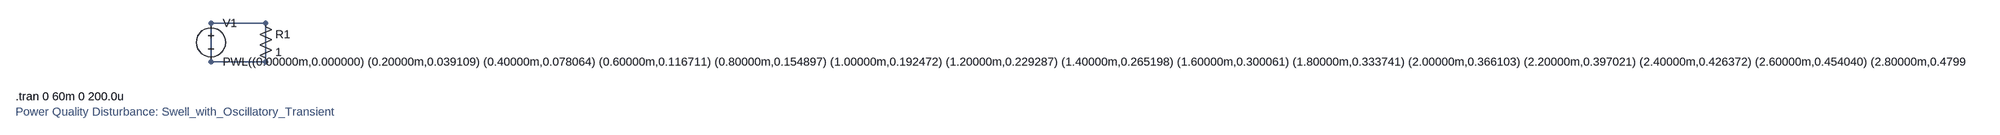
[diagram p0: schematic Swell_with_Oscillatory_Transient.asc]
Swell_with_Oscillatory_Transient.asc, the LTspice schematic file:
Version 4
SHEET 1 880 680
WIRE 192 128 80 128
WIRE 80 128 80 208
WIRE 192 208 80 208
WIRE 192 128 192 208
SYMBOL voltage 80 112 R0
WINDOW 123 0 0 Left 0
WINDOW 39 0 0 Left 0
SYMATTR InstName V1
SYMATTR Value PWL((0.00000m,0.000000) (0.20000m,0.039109) (0.40000m,0.078064) (0.60000m,0.116711) (0.80000m,0.154897) (1.00000m,0.192472) (1.20000m,0.229287) (1.40000m,0.265198) (1.60000m,0.300061) (1.80000m,0.333741) (2.00000m,0.366103) (2.20000m,0.397021) (2.40000m,0.426372) (2.60000m,0.454040) (2.80000m,0.479916) (3.00000m,0.503898) (3.20000m,0.525892) (3.40000m,0.545810) (3.60000m,0.563574) (3.80000m,0.579113) (4.00000m,0.592368) (4.20000m,0.603284) (4.40000m,0.611820) (4.60000m,0.617941) (4.80000m,0.621623) (5.00000m,0.622852) (5.20000m,0.621623) (5.40000m,0.617941) (5.60000m,0.611820) (5.80000m,0.603284) (6.00000m,0.592368) (6.20000m,0.579113) (6.40000m,0.563574) (6.60000m,0.545810) (6.80000m,0.525892) (7.00000m,0.503898) (7.20000m,0.479916) (7.40000m,0.454040) (7.60000m,0.426372) (7.80000m,0.397021) (8.00000m,0.366103) (8.20000m,0.333741) (8.40000m,0.300061) (8.60000m,0.265198) (8.80000m,0.229287) (9.00000m,0.192472) (9.20000m,0.154897) (9.40000m,0.116711) (9.60000m,0.078064) (9.80000m,0.039109) (10.00000m,0.000000) (10.20000m,-0.039109) (10.40000m,-0.078064) (10.60000m,-0.116711) (10.80000m,-0.154897) (11.00000m,-0.192472) (11.20000m,-0.229287) (11.40000m,-0.265198) (11.60000m,-0.300061) (11.80000m,-0.333741) (12.00000m,-0.366103) (12.20000m,-0.397021) (12.40000m,-0.426372) (12.60000m,-0.454040) (12.80000m,-0.479916) (13.00000m,-0.503898) (13.20000m,-0.525892) (13.40000m,-0.545810) (13.60000m,-0.563574) (13.80000m,-0.579113) (14.00000m,-0.592368) (14.20000m,-0.603284) (14.40000m,-0.611820) (14.60000m,-0.617941) (14.80000m,-0.621623) (15.00000m,-0.622852) (15.20000m,-0.621623) (15.40000m,-0.617941) (15.60000m,-0.611820) (15.80000m,-0.603284) (16.00000m,-0.592368) (16.20000m,-0.579113) (16.40000m,-0.563574) (16.60000m,-0.545810) (16.80000m,-0.525892) (17.00000m,-0.503898) (17.20000m,-0.479916) (17.40000m,-0.454040) (17.60000m,-0.426372) (17.80000m,-0.397021) (18.00000m,-0.366103) (18.20000m,-0.333741) (18.40000m,-0.300061) (18.60000m,-0.265198) (18.80000m,-0.229287) (19.00000m,-0.192472) (19.20000m,-0.154897) (19.40000m,-0.116711) (19.60000m,-0.078064) (19.80000m,-0.039109) (20.00000m,-0.000000) (20.20000m,0.058664) (20.40000m,0.117096) (20.60000m,0.175066) (20.80000m,0.232346) (21.00000m,0.288708) (21.20000m,0.343931) (21.40000m,0.397796) (21.60000m,0.450092) (21.80000m,0.500611) (22.00000m,0.549155) (22.20000m,0.595532) (22.40000m,0.639558) (22.60000m,0.681060) (22.80000m,0.719874) (23.00000m,0.755847) (23.20000m,0.788837) (23.40000m,0.818715) (23.60000m,0.845361) (23.80000m,0.868670) (24.00000m,0.888552) (24.20000m,0.904926) (24.40000m,0.917730) (24.60000m,0.926912) (24.80000m,0.932435) (25.00000m,0.934279) (25.20000m,0.932435) (25.40000m,0.926912) (25.60000m,0.917730) (25.80000m,0.904926) (26.00000m,0.888552) (26.20000m,0.868670) (26.40000m,0.845361) (26.60000m,0.818715) (26.80000m,0.788837) (27.00000m,0.755847) (27.20000m,0.719874) (27.40000m,0.681060) (27.60000m,0.639558) (27.80000m,0.595532) (28.00000m,0.549155) (28.20000m,0.500611) (28.40000m,0.450092) (28.60000m,0.397796) (28.80000m,0.343931) (29.00000m,0.288708) (29.20000m,0.232346) (29.40000m,0.175066) (29.60000m,0.117096) (29.80000m,0.058664) (30.00000m,0.000000) (30.20000m,0.029808) (30.40000m,0.041605) (30.60000m,0.027285) (30.80000m,-0.017043) (31.00000m,-0.090793) (31.20000m,-0.189257) (31.40000m,-0.304508) (31.60000m,-0.426680) (31.80000m,-0.545423) (32.00000m,-0.651324) (32.20000m,-0.737103) (32.40000m,-0.798437) (32.60000m,-0.834322) (32.80000m,-0.846952) (33.00000m,-0.841186) (33.20000m,-0.823667) (33.40000m,-0.801782) (33.60000m,-0.782577) (33.80000m,-0.771805) (34.00000m,-0.773217) (34.20000m,-0.788175) (34.40000m,-0.815624) (34.60000m,-0.852395) (34.80000m,-0.893780) (35.00000m,-0.934279) (35.20000m,-0.968405) (35.40000m,-0.991434) (35.60000m,-1.000000) (35.80000m,-0.992462) (36.00000m,-0.969018) (36.20000m,-0.931556) (36.40000m,-0.883289) (36.60000m,-0.828233) (36.80000m,-0.770618) (37.00000m,-0.714309) (37.20000m,-0.662315) (37.40000m,-0.616464) (37.60000m,-0.577246) (37.80000m,-0.543865) (38.00000m,-0.514459) (38.20000m,-0.486451) (38.40000m,-0.456976) (38.60000m,-0.423322) (38.80000m,-0.383313) (39.00000m,-0.335599) (39.20000m,-0.279813) (39.40000m,-0.216579) (39.60000m,-0.147392) (39.80000m,-0.074380) (40.00000m,-0.000000) (40.20000m,0.053734) (40.40000m,0.104297) (40.60000m,0.150159) (40.80000m,0.190486) (41.00000m,0.225187) (41.20000m,0.254855) (41.40000m,0.280618) (41.60000m,0.303931) (41.80000m,0.326334) (42.00000m,0.349215) (42.20000m,0.373619) (42.40000m,0.400109) (42.60000m,0.428706) (42.80000m,0.458910) (43.00000m,0.489792) (43.20000m,0.520134) (43.40000m,0.548609) (43.60000m,0.573952) (43.80000m,0.595125) (44.00000m,0.611432) (44.20000m,0.622583) (44.40000m,0.628698) (44.60000m,0.630259) (44.80000m,0.628013) (45.00000m,0.622852) (45.20000m,0.615678) (45.40000m,0.607275) (45.60000m,0.598221) (45.80000m,0.588815) (46.00000m,0.579067) (46.20000m,0.568719) (46.40000m,0.557304) (46.60000m,0.544236) (46.80000m,0.528903) (47.00000m,0.510764) (47.20000m,0.489430) (47.40000m,0.464717) (47.60000m,0.436672) (47.80000m,0.405561) (48.00000m,0.371839) (48.20000m,0.336082) (48.40000m,0.298923) (48.60000m,0.260978) (48.80000m,0.222777) (49.00000m,0.184721) (49.20000m,0.147051) (49.40000m,0.109849) (49.60000m,0.073056) (49.80000m,0.036511) (50.00000m,0.000000) (50.20000m,-0.036692) (50.40000m,-0.073728) (50.60000m,-0.111182) (50.80000m,-0.149014) (51.00000m,-0.187064) (51.20000m,-0.225061) (51.40000m,-0.262649) (51.60000m,-0.299422) (51.80000m,-0.334965) (52.00000m,-0.368895) (52.20000m,-0.400889) (52.40000m,-0.430713) (52.60000m,-0.458228) (52.80000m,-0.483388) (53.00000m,-0.506230) (53.20000m,-0.526843) (53.40000m,-0.545347) (53.60000m,-0.561858) (53.80000m,-0.576467) (54.00000m,-0.589216) (54.20000m,-0.600094) (54.40000m,-0.609030) (54.60000m,-0.615905) (54.80000m,-0.620567) (55.00000m,-0.622852) (55.20000m,-0.622606) (55.40000m,-0.619704) (55.60000m,-0.614068) (55.80000m,-0.605676) (56.00000m,-0.594566) (56.20000m,-0.580832) (56.40000m,-0.564610) (56.60000m,-0.546070) (56.80000m,-0.525394) (57.00000m,-0.502763) (57.20000m,-0.478343) (57.40000m,-0.452275) (57.60000m,-0.424669) (57.80000m,-0.395609) (58.00000m,-0.365155) (58.20000m,-0.333354) (58.40000m,-0.300250) (58.60000m,-0.265895) (58.80000m,-0.230363) (59.00000m,-0.193753) (59.20000m,-0.156194) (59.40000m,-0.117845) (59.60000m,-0.078892) (59.80000m,-0.039539))
SYMBOL res 176 112 R0
SYMATTR InstName R1
SYMATTR Value 1
TEXT -320 280 Left 2 !.tran 0 60m 0 200.0u
TEXT -320 312 Left 2 ;Power Quality Disturbance: Swell_with_Oscillatory_Transient

The netlist it stands for:
* Swell_with_Oscillatory_Transient.asc
V1 N001 N001 PWL((0.00000m,0.000000) (0.20000m,0.039109) (0.40000m,0.078064) (0.60000m,0.116711) (0.80000m,0.154897) (1.00000m,0.192472) (1.20000m,0.229287) (1.40000m,0.265198) (1.60000m,0.300061) (1.80000m,0.333741) (2.00000m,0.366103) (2.20000m,0.397021) (2.40000m,0.426372) (2.60000m,0.454040) (2.80000m,0.479916) (3.00000m,0.503898) (3.20000m,0.525892) (3.40000m,0.545810) (3.60000m,0.563574) (3.80000m,0.579113) (4.00000m,0.592368) (4.20000m,0.603284) (4.40000m,0.611820) (4.60000m,0.617941) (4.80000m,0.621623) (5.00000m,0.622852) (5.20000m,0.621623) (5.40000m,0.617941) (5.60000m,0.611820) (5.80000m,0.603284) (6.00000m,0.592368) (6.20000m,0.579113) (6.40000m,0.563574) (6.60000m,0.545810) (6.80000m,0.525892) (7.00000m,0.503898) (7.20000m,0.479916) (7.40000m,0.454040) (7.60000m,0.426372) (7.80000m,0.397021) (8.00000m,0.366103) (8.20000m,0.333741) (8.40000m,0.300061) (8.60000m,0.265198) (8.80000m,0.229287) (9.00000m,0.192472) (9.20000m,0.154897) (9.40000m,0.116711) (9.60000m,0.078064) (9.80000m,0.039109) (10.00000m,0.000000) (10.20000m,-0.039109) (10.40000m,-0.078064) (10.60000m,-0.116711) (10.80000m,-0.154897) (11.00000m,-0.192472) (11.20000m,-0.229287) (11.40000m,-0.265198) (11.60000m,-0.300061) (11.80000m,-0.333741) (12.00000m,-0.366103) (12.20000m,-0.397021) (12.40000m,-0.426372) (12.60000m,-0.454040) (12.80000m,-0.479916) (13.00000m,-0.503898) (13.20000m,-0.525892) (13.40000m,-0.545810) (13.60000m,-0.563574) (13.80000m,-0.579113) (14.00000m,-0.592368) (14.20000m,-0.603284) (14.40000m,-0.611820) (14.60000m,-0.617941) (14.80000m,-0.621623) (15.00000m,-0.622852) (15.20000m,-0.621623) (15.40000m,-0.617941) (15.60000m,-0.611820) (15.80000m,-0.603284) (16.00000m,-0.592368) (16.20000m,-0.579113) (16.40000m,-0.563574) (16.60000m,-0.545810) (16.80000m,-0.525892) (17.00000m,-0.503898) (17.20000m,-0.479916) (17.40000m,-0.454040) (17.60000m,-0.426372) (17.80000m,-0.397021) (18.00000m,-0.366103) (18.20000m,-0.333741) (18.40000m,-0.300061) (18.60000m,-0.265198) (18.80000m,-0.229287) (19.00000m,-0.192472) (19.20000m,-0.154897) (19.40000m,-0.116711) (19.60000m,-0.078064) (19.80000m,-0.039109) (20.00000m,-0.000000) (20.20000m,0.058664) (20.40000m,0.117096) (20.60000m,0.175066) (20.80000m,0.232346) (21.00000m,0.288708) (21.20000m,0.343931) (21.40000m,0.397796) (21.60000m,0.450092) (21.80000m,0.500611) (22.00000m,0.549155) (22.20000m,0.595532) (22.40000m,0.639558) (22.60000m,0.681060) (22.80000m,0.719874) (23.00000m,0.755847) (23.20000m,0.788837) (23.40000m,0.818715) (23.60000m,0.845361) (23.80000m,0.868670) (24.00000m,0.888552) (24.20000m,0.904926) (24.40000m,0.917730) (24.60000m,0.926912) (24.80000m,0.932435) (25.00000m,0.934279) (25.20000m,0.932435) (25.40000m,0.926912) (25.60000m,0.917730) (25.80000m,0.904926) (26.00000m,0.888552) (26.20000m,0.868670) (26.40000m,0.845361) (26.60000m,0.818715) (26.80000m,0.788837) (27.00000m,0.755847) (27.20000m,0.719874) (27.40000m,0.681060) (27.60000m,0.639558) (27.80000m,0.595532) (28.00000m,0.549155) (28.20000m,0.500611) (28.40000m,0.450092) (28.60000m,0.397796) (28.80000m,0.343931) (29.00000m,0.288708) (29.20000m,0.232346) (29.40000m,0.175066) (29.60000m,0.117096) (29.80000m,0.058664) (30.00000m,0.000000) (30.20000m,0.029808) (30.40000m,0.041605) (30.60000m,0.027285) (30.80000m,-0.017043) (31.00000m,-0.090793) (31.20000m,-0.189257) (31.40000m,-0.304508) (31.60000m,-0.426680) (31.80000m,-0.545423) (32.00000m,-0.651324) (32.20000m,-0.737103) (32.40000m,-0.798437) (32.60000m,-0.834322) (32.80000m,-0.846952) (33.00000m,-0.841186) (33.20000m,-0.823667) (33.40000m,-0.801782) (33.60000m,-0.782577) (33.80000m,-0.771805) (34.00000m,-0.773217) (34.20000m,-0.788175) (34.40000m,-0.815624) (34.60000m,-0.852395) (34.80000m,-0.893780) (35.00000m,-0.934279) (35.20000m,-0.968405) (35.40000m,-0.991434) (35.60000m,-1.000000) (35.80000m,-0.992462) (36.00000m,-0.969018) (36.20000m,-0.931556) (36.40000m,-0.883289) (36.60000m,-0.828233) (36.80000m,-0.770618) (37.00000m,-0.714309) (37.20000m,-0.662315) (37.40000m,-0.616464) (37.60000m,-0.577246) (37.80000m,-0.543865) (38.00000m,-0.514459) (38.20000m,-0.486451) (38.40000m,-0.456976) (38.60000m,-0.423322) (38.80000m,-0.383313) (39.00000m,-0.335599) (39.20000m,-0.279813) (39.40000m,-0.216579) (39.60000m,-0.147392) (39.80000m,-0.074380) (40.00000m,-0.000000) (40.20000m,0.053734) (40.40000m,0.104297) (40.60000m,0.150159) (40.80000m,0.190486) (41.00000m,0.225187) (41.20000m,0.254855) (41.40000m,0.280618) (41.60000m,0.303931) (41.80000m,0.326334) (42.00000m,0.349215) (42.20000m,0.373619) (42.40000m,0.400109) (42.60000m,0.428706) (42.80000m,0.458910) (43.00000m,0.489792) (43.20000m,0.520134) (43.40000m,0.548609) (43.60000m,0.573952) (43.80000m,0.595125) (44.00000m,0.611432) (44.20000m,0.622583) (44.40000m,0.628698) (44.60000m,0.630259) (44.80000m,0.628013) (45.00000m,0.622852) (45.20000m,0.615678) (45.40000m,0.607275) (45.60000m,0.598221) (45.80000m,0.588815) (46.00000m,0.579067) (46.20000m,0.568719) (46.40000m,0.557304) (46.60000m,0.544236) (46.80000m,0.528903) (47.00000m,0.510764) (47.20000m,0.489430) (47.40000m,0.464717) (47.60000m,0.436672) (47.80000m,0.405561) (48.00000m,0.371839) (48.20000m,0.336082) (48.40000m,0.298923) (48.60000m,0.260978) (48.80000m,0.222777) (49.00000m,0.184721) (49.20000m,0.147051) (49.40000m,0.109849) (49.60000m,0.073056) (49.80000m,0.036511) (50.00000m,0.000000) (50.20000m,-0.036692) (50.40000m,-0.073728) (50.60000m,-0.111182) (50.80000m,-0.149014) (51.00000m,-0.187064) (51.20000m,-0.225061) (51.40000m,-0.262649) (51.60000m,-0.299422) (51.80000m,-0.334965) (52.00000m,-0.368895) (52.20000m,-0.400889) (52.40000m,-0.430713) (52.60000m,-0.458228) (52.80000m,-0.483388) (53.00000m,-0.506230) (53.20000m,-0.526843) (53.40000m,-0.545347) (53.60000m,-0.561858) (53.80000m,-0.576467) (54.00000m,-0.589216) (54.20000m,-0.600094) (54.40000m,-0.609030) (54.60000m,-0.615905) (54.80000m,-0.620567) (55.00000m,-0.622852) (55.20000m,-0.622606) (55.40000m,-0.619704) (55.60000m,-0.614068) (55.80000m,-0.605676) (56.00000m,-0.594566) (56.20000m,-0.580832) (56.40000m,-0.564610) (56.60000m,-0.546070) (56.80000m,-0.525394) (57.00000m,-0.502763) (57.20000m,-0.478343) (57.40000m,-0.452275) (57.60000m,-0.424669) (57.80000m,-0.395609) (58.00000m,-0.365155) (58.20000m,-0.333354) (58.40000m,-0.300250) (58.60000m,-0.265895) (58.80000m,-0.230363) (59.00000m,-0.193753) (59.20000m,-0.156194) (59.40000m,-0.117845) (59.60000m,-0.078892) (59.80000m,-0.039539))
R1 N001 N001 1
.tran 0 60m 0 200.0u
* Power Quality Disturbance: Swell_with_Oscillatory_Transient
.backanno
.end